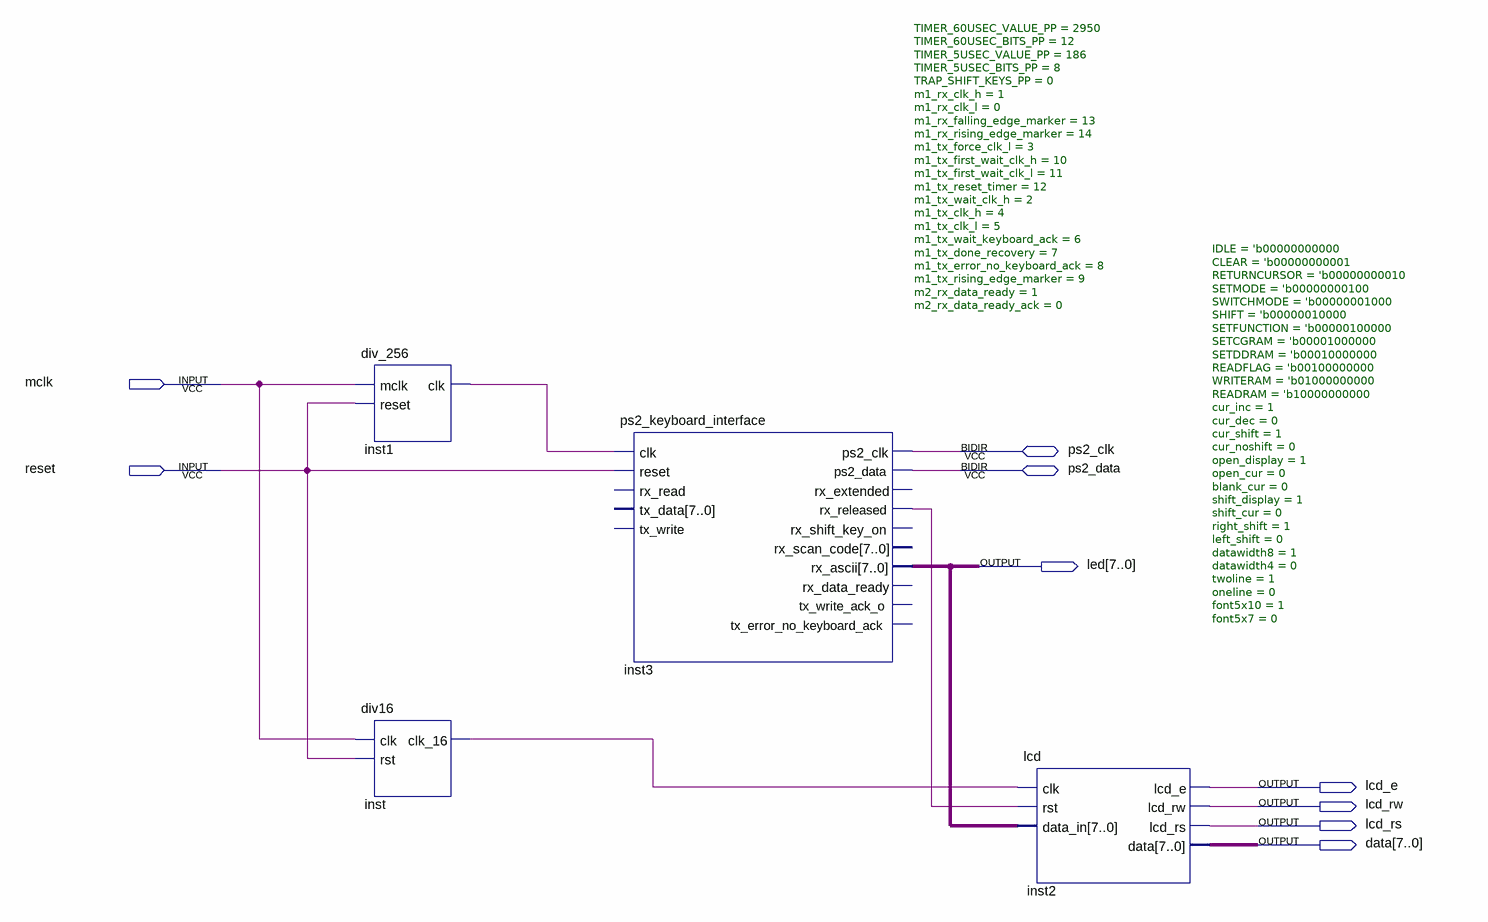
[diagram p0: schematic sheet]
// Quartus schematic ps2tolcd.bdf as structural Verilog: 4 symbols, 9 pins
module ps2tolcd (
  input  mclk,
  input  reset,
  inout  ps2_clk,
  inout  ps2_data,
  output [7:0] led,
  output lcd_e,
  output lcd_rw,
  output lcd_rs,
  output [7:0] data
);

  wire inst1_clk, inst3_rx_released, inst_clk_16;

  div_256 inst1 (.mclk(mclk), .reset(reset), .clk(inst1_clk));
  div16 inst (.clk(mclk), .rst(reset), .clk_16(inst_clk_16));
  ps2_keyboard_interface #(.TIMER_60USEC_VALUE_PP(2950), .TIMER_60USEC_BITS_PP(12), .TIMER_5USEC_VALUE_PP(186), .TIMER_5USEC_BITS_PP(8), .TRAP_SHIFT_KEYS_PP(0), .m1_rx_clk_h(1), .m1_rx_clk_l(0), .m1_rx_falling_edge_marker(13), .m1_rx_rising_edge_marker(14), .m1_tx_force_clk_l(3), .m1_tx_first_wait_clk_h(10), .m1_tx_first_wait_clk_l(11), .m1_tx_reset_timer(12), .m1_tx_wait_clk_h(2), .m1_tx_clk_h(4), .m1_tx_clk_l(5), .m1_tx_wait_keyboard_ack(6), .m1_tx_done_recovery(7), .m1_tx_error_no_keyboard_ack(8), .m1_tx_rising_edge_marker(9), .m2_rx_data_ready(1), .m2_rx_data_ready_ack(0)) inst3 (
    .clk(inst1_clk), .reset(reset), .rx_released(inst3_rx_released), .rx_ascii(led), .ps2_clk(ps2_clk),
    .ps2_data(ps2_data));  // open: rx_read, tx_data, tx_write, rx_extended, rx_shift_key_on, rx_scan_code, rx_data_ready, tx_write_ack_o, tx_error_no_keyboard_ack
  lcd #(.IDLE('b00000000000), .CLEAR('b00000000001), .RETURNCURSOR('b00000000010), .SETMODE('b00000000100), .SWITCHMODE('b00000001000), .SHIFT('b00000010000), .SETFUNCTION('b00000100000), .SETCGRAM('b00001000000), .SETDDRAM('b00010000000), .READFLAG('b00100000000), .WRITERAM('b01000000000), .READRAM('b10000000000), .cur_inc(1), .cur_dec(0), .cur_shift(1), .cur_noshift(0), .open_display(1), .open_cur(0), .blank_cur(0), .shift_display(1), .shift_cur(0), .right_shift(1), .left_shift(0), .datawidth8(1), .datawidth4(0), .twoline(1), .oneline(0), .font5x10(1), .font5x7(0)) inst2 (
    .clk(inst_clk_16), .rst(inst3_rx_released), .data_in(led), .lcd_e(lcd_e), .lcd_rw(lcd_rw),
    .lcd_rs(lcd_rs), .data(data));
endmodule
